# EAGLE design Feather_Ace_Shield (EAGLE 9.6.2)
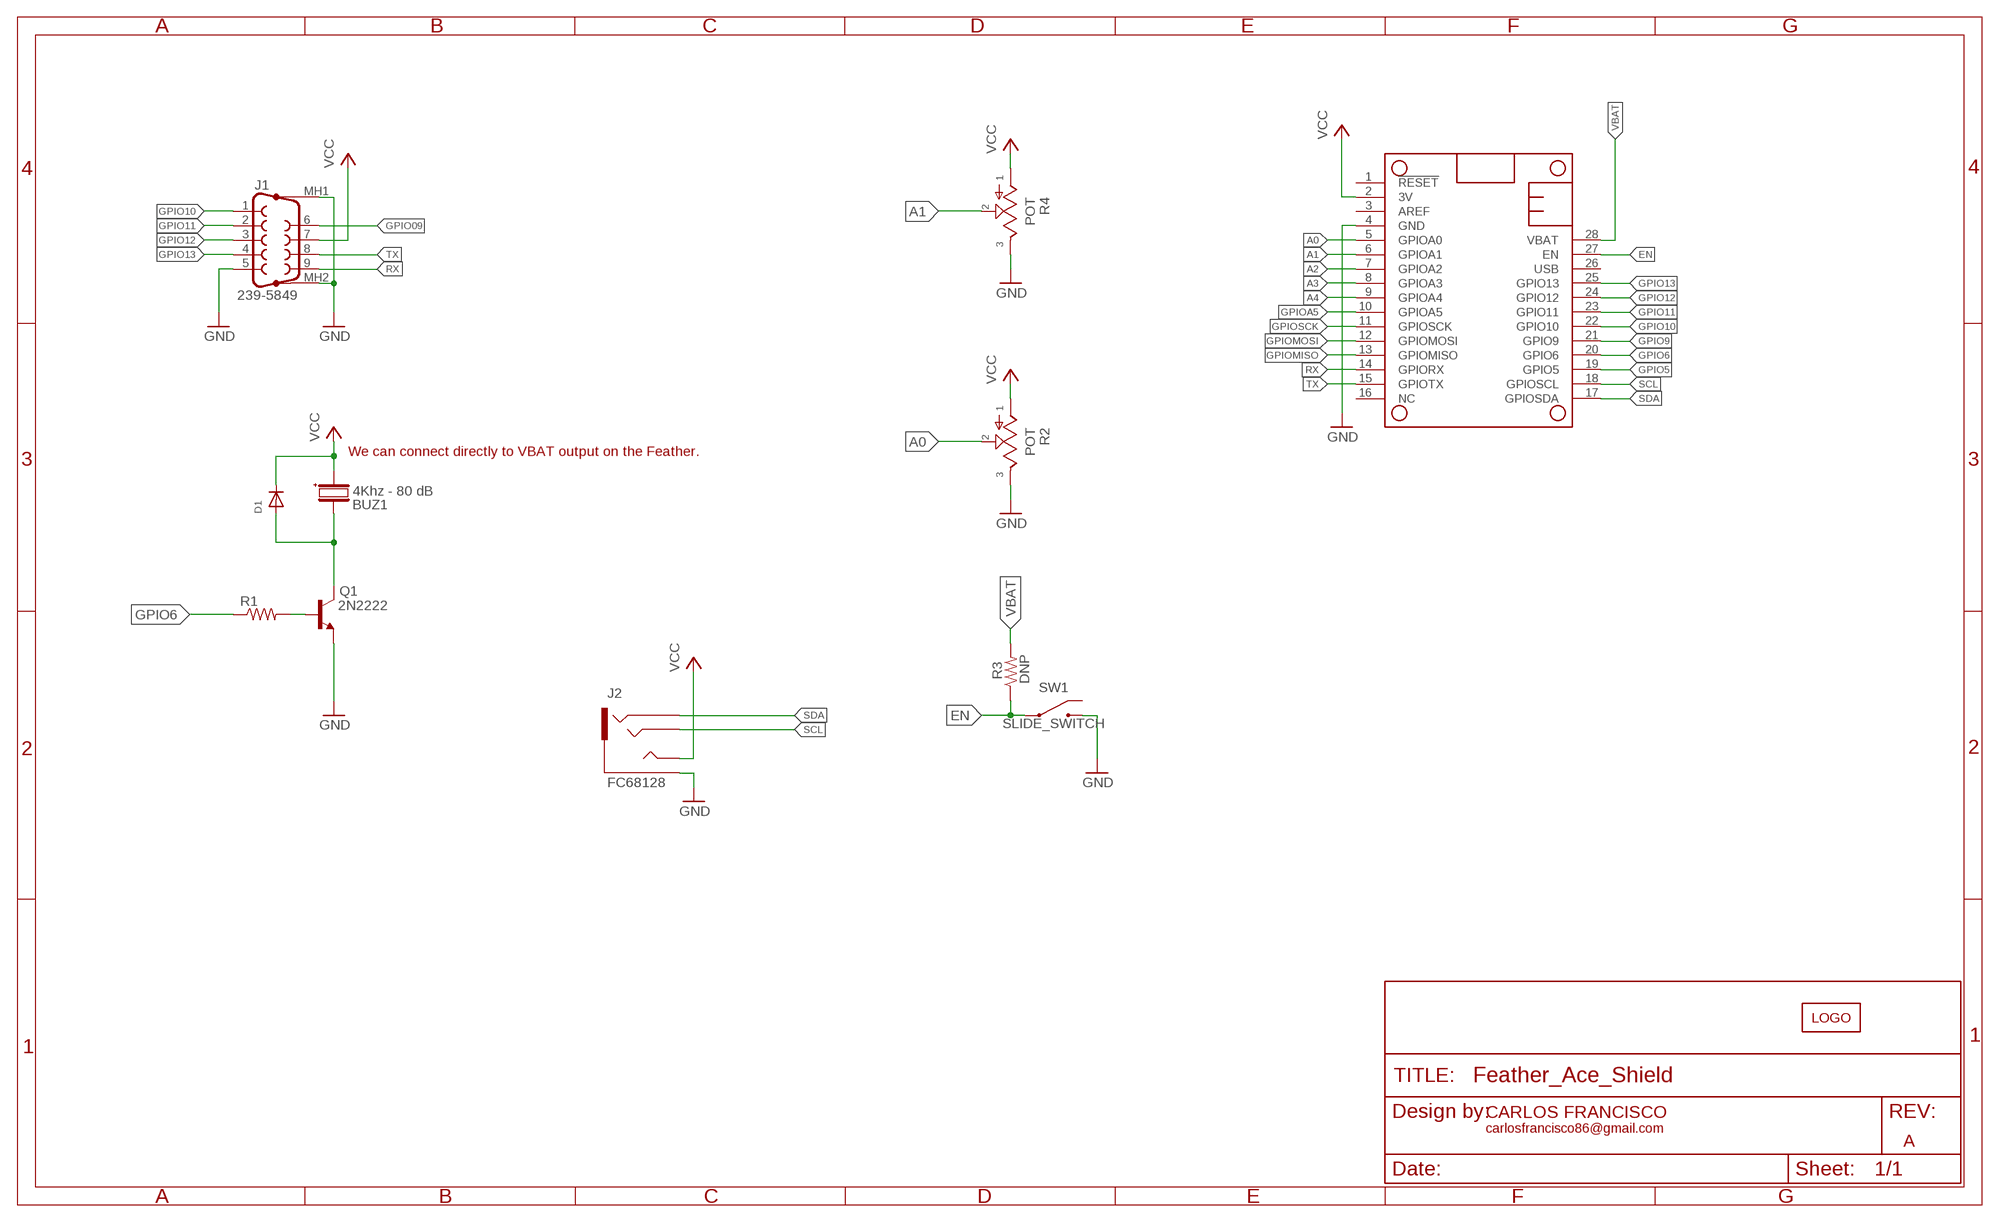
[diagram p0: schematic, sheet 1]

## Parts
BUZ1  4Khz - 80 dB  BUZZER-511-7620  [-511-7620]
D1  DIODEDO-1N4148  [DO-1N4148]
J1  239-5849  DB9_FEMALE-239-5849  [DB9_PLUG]
J2  FC68128  3.5MM_JACKFC68128  [FC68128]
MS1  FEATHERWING_NODIM  [FEATHERWING_DIM]
Q1  2N2222  [TO92-EBC-OVAL]
R1  R-US_0207/10  [0207/10]
R2  POT  [3386P_1]
R3  DNP  R-US_0207/10  [0207/10]
R4  POT  [3386P_1]
SW1  SLIDE_SWITCH  [OS102011MA1QN1]
U$2  LOGO-10MM  [LOGO_10MM]

## Nets
A0: MS1.5(GPIOA0) R2.2
A1: MS1.6(GPIOA1) R4.2
A2: MS1.7(GPIOA2)
A3: MS1.8(GPIOA3)
A4: MS1.9(GPIOA4)
BUZ_CTRL_R: Q1.B R1.2
EN: MS1.27(EN) R3.1 SW1.2
GND: J1.5 J1.MH1(G1) J1.MH2(G2) J2.1S_L(1S_SLEEVE) J2.1S_R(1S_SLEEVE) MS1.4(GND) Q1.E R2.3 R4.3 SW1.1
GPIO5: MS1.19(GPIO5)
GPIO6: MS1.20(GPIO6) R1.1
GPIO9: MS1.21(GPIO9)
GPIO09: J1.6
GPIO10: J1.1 MS1.22(GPIO10)
GPIO11: J1.2 MS1.23(GPIO11)
GPIO12: J1.3 MS1.24(GPIO12)
GPIO13: J1.4 MS1.25(GPIO13)
GPIOA5: MS1.10(GPIOA5)
GPIOMISO: MS1.13(GPIOMISO)
GPIOMOSI: MS1.12(GPIOMOSI)
GPIOSCK: MS1.11(GPIOSCK)
N$1: BUZ1.- D1.A Q1.C
RX: J1.9 MS1.14(GPIORX)
SCL: J2.2R(2R_1RING) MS1.18(GPIOSCL)
SDA: J2.6_L(6SR_2RING) J2.6_R(6SR_2RING) MS1.17(GPIOSDA)
TX: J1.8 MS1.15(GPIOTX)
VBAT: MS1.28(VBAT) R3.2
VCC: BUZ1.+ D1.C J1.7 J2.3T(3T_TIP) MS1.2(3V) R2.1 R4.1
Unconnected: MS1.1(!RESET) MS1.3(AREF) MS1.16(NC) MS1.26(USB) SW1.3

## Notes on the sheet
- We can connect directly to VBAT output on the Feather.
- CARLOS FRANCISCO
- carlosfrancisco86@gmail.com
- A

## Library data of the parts
BUZ1 = AceCenter:BUZZER: Buzzer; DESCRIPTION: 80dB PCB Buzzer; MFR: RS PRO; MFR_NUM: 511-7620
D1 = adafruit:DIODE: Diode SMADIODE - SMA Surface Mount Package 20V 1A Schottky Diode Digikey: 641-1014-6-ND DO-1N4148 - Through Hole Small Current Diode SOD-123 20V 1 A (.5mV Vf) Schottky Diode - Digikey: MBRX120TPMSCT-ND SOD-323 10V 570mA (.38mV Vf, 3ns) Schottky Diode - Digikey: ZLLS410CT-ND SOD-523 30V 30mA Schottky Diode (RB751S-40TE61) - Digikey: RB751S-40TE61CT-ND SOT23-R/W - SOT23 Package (R = Solder Paste/Reflow Ovens, W = Hand-Soldering) BAT54Film 40V 300mA - Digikey: 497-7162-1-ND
J1 = AceCenter:DB9_FEMALE: D-SUB Connector - Right Angle; DESCRIPTION: D-sub Connector - 2.77mm Pitch; MFR: RS Pro; MFR_NUM: 239-5849
J2 = AceCenter:3.5MM_JACK
MS1 = adafruit:FEATHERWING
Q1 = adafruit:2N2222: NPN TRANSISTOR Big oval pads
R1 R3 = rcl:R-US_: RESISTOR, American symbol; SPICEPREFIX: R
R2 R4 = AceCenter:POT: Bourns 3386P Series Through Hole Cermet Trimmer Resistor with Solder Pin Terminations, 20 +/-10% 0.5W +/-100ppm/C Source: Datasheet <https://www.bourns.com/docs/Product-Datasheets/3386.pdf>; ARROW_PART_NUMBER: 3386P-1-200LF; ARROW_PRICE-STOCK: https://www.arrow.com/en/products/3386p-1-200lf/bourns; DESCRIPTION: Bourns 3386P Series Through Hole Cermet Trimmer Resistor with Solder Pin Terminations, 20 +/-10% 0.5W +/-100ppm/C; HEIGHT: mm; MANUFACTURER_NAME: Bourns; MANUFACTURER_PART_NUMBER: 3386P-1-200LF; MOUSER_PART_NUMBER: 652-3386P-1-200LF; MOUSER_PRICE-STOCK: https://www.mouser.co.uk/ProductDetail/Bourns/3386P-1-200LF?qs=m2uG%2FFdTAPXlWm65YWVGcg%3D%3D
SW1 = AceCenter:SLIDE_SWITCH: Switch Slide Right Angle SPDT 0.1A 12VDC Through Hole Slide Switch SPDT On-On 0.1 A@ 12 V dc Slide Source: Datasheet <http://www.ckswitches.com/media/1428/os.pdf>; ARROW_PART_NUMBER: OS102011MA1QN1; ARROW_PRICE-STOCK: https://www.arrow.com/en/products/os102011ma1qn1/ck; DESCRIPTION: Switch Slide Right Angle SPDT 0.1A 12VDC Through Hole Slide Switch SPDT On-On 0.1 A@ 12 V dc Slide; HEIGHT: mm; MANUFACTURER_NAME: C & K COMPONENTS; MANUFACTURER_PART_NUMBER: OS102011MA1QN1; MOUSER_PART_NUMBER: 611-OS102011MA1QN1; MOUSER_PRICE-STOCK: https://www.mouser.co.uk/ProductDetail/CK/OS102011MA1QN1?qs=WtljUlYws5R6MUgHcLkz4w%3D%3D
U$2 = AceCenter:LOGO

## Board
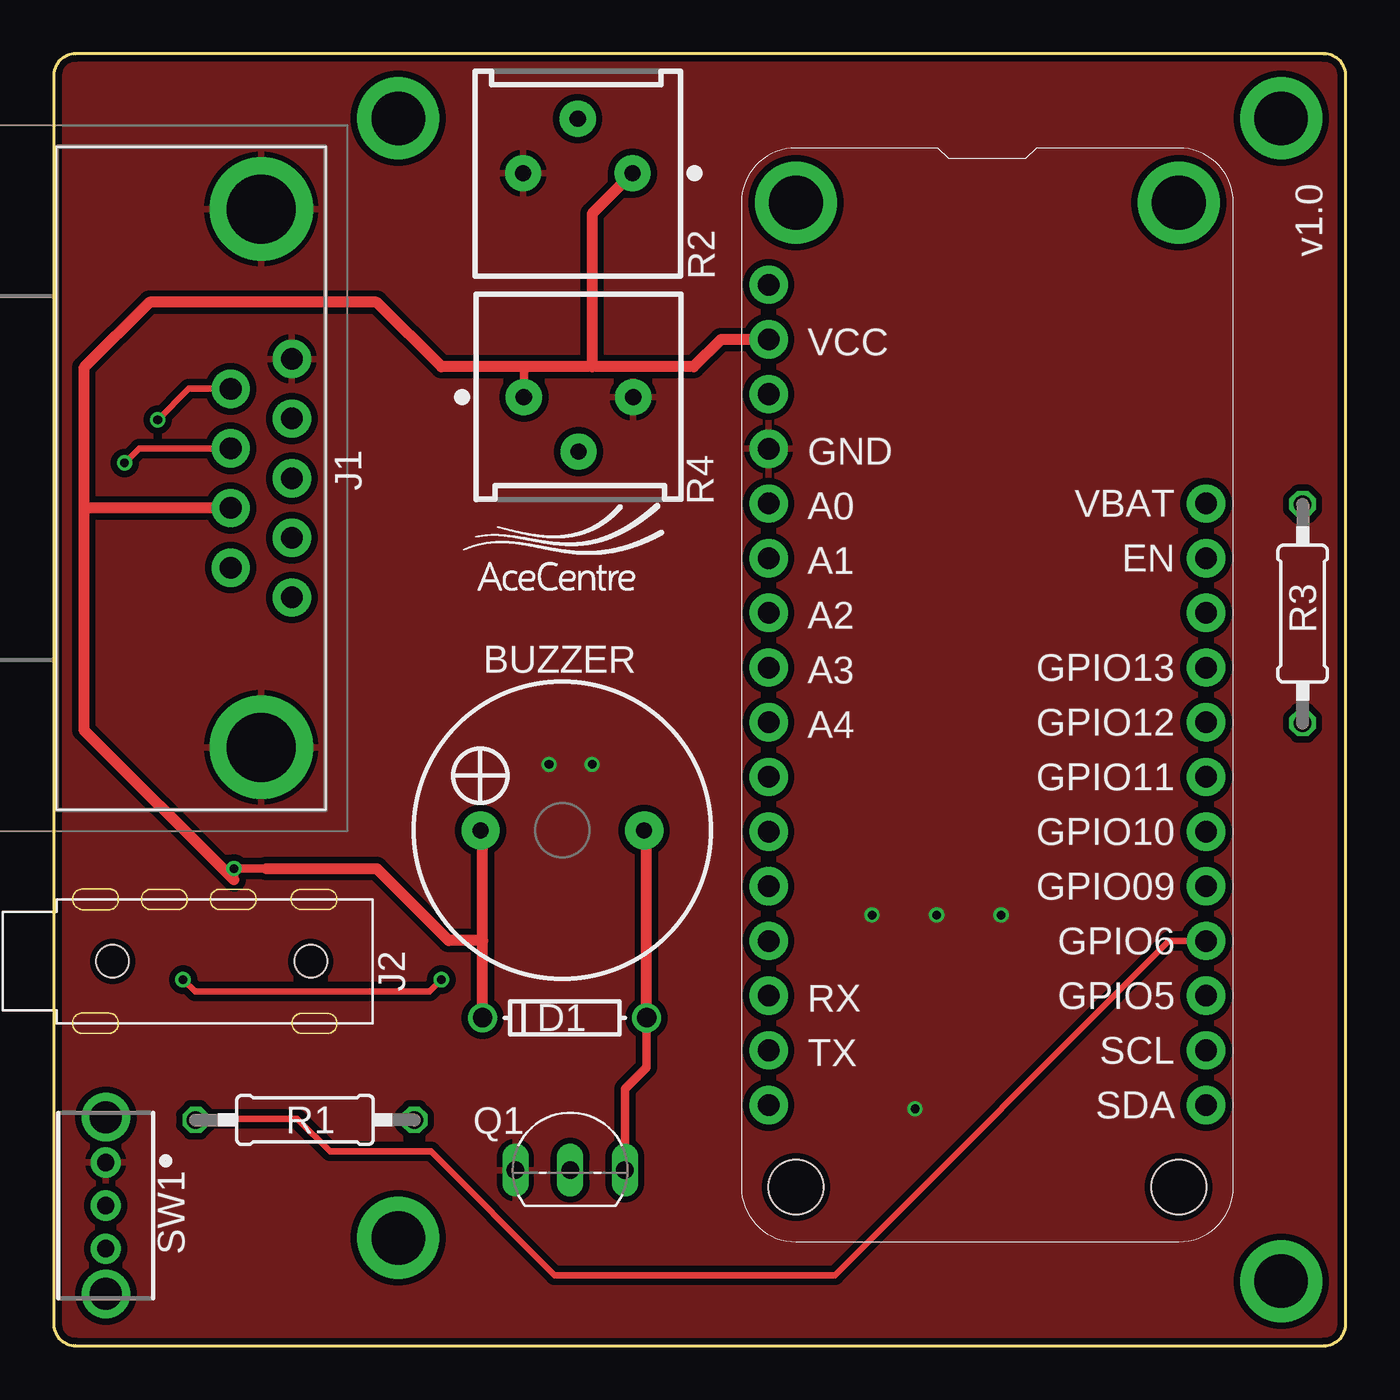
[diagram p1: board, top side]
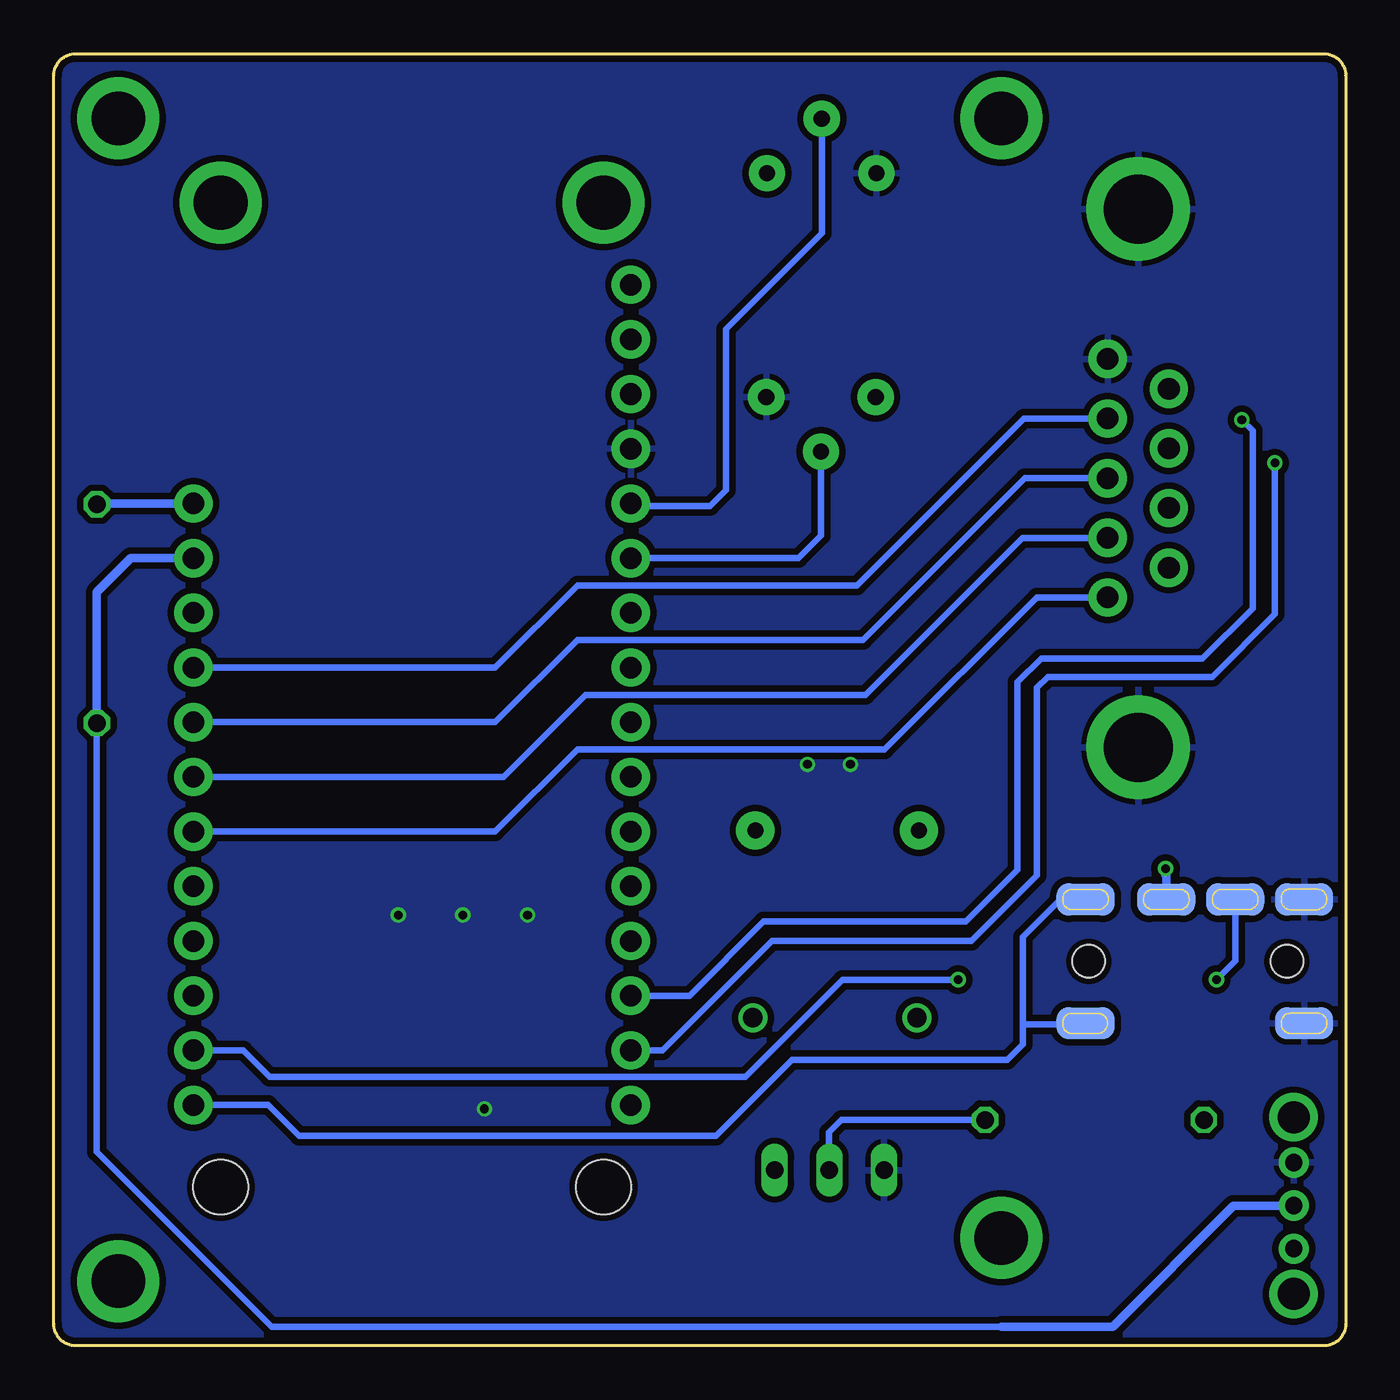
[diagram p2: board, bottom side, seen from below]

Size 60 x 60 mm. Coordinates in mm from the lower left corner, seen from the top.
Outline: 0,59 0,1 arc90 1,0 59,0 arc90 60,1 60,59 arc90 59,60 1,60 arc90 0,59
Copper layers (1*16): Top 0.035mm / dielectric 1.5mm / Bottom 0.035mm
Design rules "SparkFun-2-layer-PCBWay-LIMIT": minimum track width 6mil, minimum drill 0.3mm, track to track 6mil, track to pad 6mil, pad to pad 6mil, via to via 6mil, smd to smd 6mil, copper to edge 6mil, drill to drill 6mil, minimum pad ring 6mil, minimum via ring 6mil, stop-mask expansion 4mil, vias tented up to drill 25mil, thermal gap 10mil

### Footprints (pad centres in the part's own frame; a part is rotated, then mirrored left to right if it is on the bottom)
-511-7620 = drill 0.75 pad 1.778: + 0,3.8; - 0,-3.8
DO-1N4148 = drill 0.9: A -3.81,0; C 3.81,0
DB9_PLUG = drill 1 pad 1.778: 1 0,0; 2 -2.77,0; 3 -5.54,0; 4 -8.31,0; 5 -11.08,0; 6 -1.385,-2.84; 7 -4.155,-2.84; 8 -6.925,-2.84; 9 -9.695,-2.84 | drill 3.2 pad 4.8: MH1 -18.04,-1.42; MH2 6.96,-1.42
FC68128 = smd 1.5 x 2.7 bottom: 1S_L -2.875,10; 1S_R 2.875,10; 2R 2.875,6.8; 3T 2.875,3.6; 6_L -2.875,-0.15; 6_R 2.875,-0.15 | hole 1.5: 0,0; 0,9.2
FEATHERWING_DIM = drill 1 pad 1.778: 1 6.35,1.27; 2 8.89,1.27; 3 11.43,1.27; 4 13.97,1.27; 5 16.51,1.27; 6 19.05,1.27; 7 21.59,1.27; 8 24.13,1.27; 9 26.67,1.27; 10 29.21,1.27; 11 31.75,1.27; 12 34.29,1.27; 13 36.83,1.27; 14 39.37,1.27; 15 41.91,1.27; 16 44.45,1.27; 17 44.45,21.59; 18 41.91,21.59; 19 39.37,21.59; 20 36.83,21.59; 21 34.29,21.59; 22 31.75,21.59; 23 29.21,21.59; 24 26.67,21.59; 25 24.13,21.59; 26 21.59,21.59; 27 19.05,21.59; 28 16.51,21.59 | drill 2.5 pad 3.81: P$1 2.54,20.32; P$2 2.54,2.54 | hole 2.54: 48.26,20.32; 48.26,2.54
TO92-EBC-OVAL = drill 0.813 long: B 0,-1.27; C 2.54,-1.27; E -2.54,-1.27
0207/10 = drill 0.813 octagon: 1 -5.08,0; 2 5.08,0
3386P_1 = drill 0.75 pad 1.676: 1 2.225,4.75; 2 4.765,2.21; 3 7.305,4.75
OS102011MA1QN1 = drill 0.8 pad 1.4: 1 -2,0; 2 0,0; 3 2,0 | drill 1.5 pad 2.25: 4 -4.1,0; 5 4.1,0

### Placement (x,y rotation side)
BUZ1  23.62,23.93 90 top
D1  23.72,15.23 180 top
J1  11.05,34.75 270 top
J2  11.93,17.85 90 top
MS1  31.93,55.63 270 top
Q1  23.98,9.42 0 top
R1  11.66,10.49 0 top
R2  29.1,59.2 180 top
R3  58,34 90 top
R4  19.61,39.31 0 top
SW1  2.41,6.51 270 top
U$2  19,35 0 top

### Tracks (layer width: path | path; a pad name or v marks a point on that pad's centre or on a via)
A0
  Bottom 0.3: MS1.5 33.08,39 29.52,39 28.78,39.75 28.78,47.22 24.34,51.66 R2.2
A1
  Bottom 0.3: MS1.6 25.42,36.58 24.37,37.63 R4.2
BUZ_CTRL_R
  Bottom 0.3: 24,7.49 24,8.14 | 24,8.14 Q1.B | R1.2 23.42,10.49 24,9.91 24,8.14
EN
  Bottom 0.3: 55.42,36.58 MS1.27 | R3.1 58,9 49.89,0.89 16,0.89
  Bottom 0.4: R3.1 58,35 56.42,36.58 MS1.27 | SW1.2 5.21,6.49 10.81,0.89 16,0.89
GND  (via drill 0.4)
  other vias: 23,27 25,27 38,20 41,20 44,20 40,11
  pour Top (isolate 0.3): 1,60 59,60 arc-90 60,59 60,1 arc-90 59,0 1,0 arc-90 0,1 0,59 arc-90
  pour Bottom (isolate 0.3): 0,59 0,1 arc90 1,0 59,0 arc90 60,1 60,59 arc90 59,60 1,60 arc90
GPIO6
  Top 0.3: MS1.20 51.8,18.8 36.28,3.28 23.27,3.28 17.53,9.02 12.83,9.02 11.3,10.54 6.64,10.54 R1.1
GPIO10
  Bottom 0.3: MS1.22 39.5,23.88 35.69,27.69 21.41,27.69 14.35,34.75 J1.1
GPIO11
  Bottom 0.3: MS1.23 39.12,26.42 35.31,30.23 22.3,30.23 15.01,37.52 J1.2
GPIO12
  Bottom 0.3: MS1.24 39.5,28.96 35.69,32.77 22.43,32.77 14.91,40.29 J1.3
GPIO13
  Bottom 0.3: MS1.25 39.5,31.5 35.69,35.31 22.69,35.31 14.94,43.06 J1.4
N$1
  Top 0.4: Q1.C 26.52,11.92 27.53,12.93 D1.A
  Top 0.5: D1.A 27.53,23.82 BUZ1.-
N$2  (via drill 2.5 pad 3.81)
  other vias: 16,57
N$3  (via drill 2.5 pad 3.81)
  other vias: 16,5
N$4  (via drill 2.5 pad 3.81)
  other vias: 57,3
N$5  (via drill 2.5 pad 3.81)
  other vias: 57,57
RX  (via drill 0.4)
  Top 0.3: v4.83,43 6.27,44.44 J1.9
  Bottom 0.3: MS1.14 30.48,16.26 27.04,19.7 17.64,19.7 15.24,22.1 15.24,30.82 14.14,31.91 6.65,31.91 4.32,34.24 4.32,42.49 v4.83,43
SCL  (via drill 0.4)
  Top 0.3: v6,17 6.55,16.45 17.45,16.45 v18,17
  Bottom 0.3: J2.2R 5.13,17.87 v6,17 | v18,17 23.36,17 27.87,12.49 49.98,12.49 51.21,13.72 MS1.18
SDA
  Bottom 0.3: J2.6_R 13.25,20.73 14.99,18.99 14.99,14.92 | J2.6_L 12.14,14.92 14.99,14.92 | 14.99,14.92 14.99,14 15.71,13.27 25.72,13.27 29.23,9.76 48.62,9.76 50.04,11.18 MS1.17
TX  (via drill 0.4)
  Top 0.3: v3.29,41 3.96,41.67 J1.8
  Bottom 0.3: MS1.15 31.73,13.72 26.65,18.8 17.38,18.8 14.34,21.84 14.34,30.56 13.83,31.07 6.2,31.07 3.29,33.98 v3.29,41
VBAT
  Bottom 0.4: MS1.28 57.96,39.12 R3.2
VCC  (via drill 0.4)
  Top 0.4: 8.37,21.64 v8.37,22.16 9.87,22.16 | R4.1 21.83,45.47
  Top 0.5: MS1.2 30.99,46.74 29.72,45.47 25,45.47 | 1.4,39 1.4,45.42 4.45,48.47 15,48.47 18,45.47 21.83,45.47 22,45.47 25,45.47 | 1.4,39 1.4,28.6 8.37,21.64 | D1.C 19.91,18.82 | 9.87,22.16 15,22.16 18.34,18.82 19.91,18.82 | 19.91,18.82 19.91,23.84 BUZ1.+ | J1.7 1.49,38.9 1.4,39 | R2.1 25,52.58 25,45.47
  Bottom 0.4: J2.3T 8.33,21.84 8.37,21.87 v8.37,22.16

### Text on the board
tPlace: v1.0 | VCC | GND | A0 | VBAT | EN | A1 | A2 | BUZZER | A3 | GPIO13 | A4 | GPIO12 | GPIO11 | GPIO10 | GPIO09 | GPIO6 | RX | GPIO5 | TX | SCL | SDA